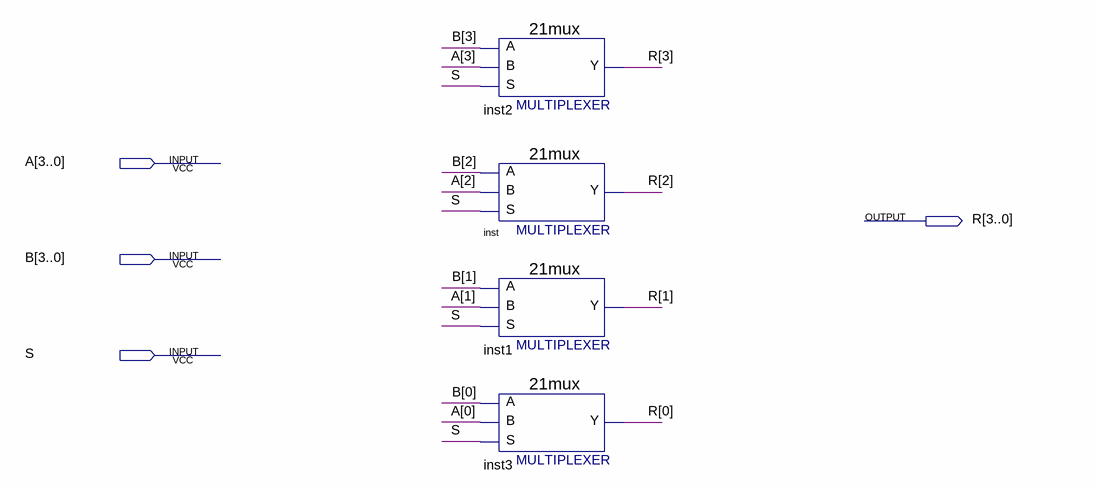
[diagram p0: schematic sheet]
// Quartus schematic mux21_4bit.bdf as structural Verilog: 4 symbols, 4 pins
module mux21_4bit (
  input  [3:0] A,
  input  [3:0] B,
  input  S,
  output [3:0] R
);

  \21mux  inst2 (.S(S), .B(A[3]), .A(B[3]), .Y(R[3]));
  \21mux  inst (.S(S), .B(A[2]), .A(B[2]), .Y(R[2]));
  \21mux  inst1 (.S(S), .B(A[1]), .A(B[1]), .Y(R[1]));
  \21mux  inst3 (.S(S), .B(A[0]), .A(B[0]), .Y(R[0]));
endmodule
